# EAGLE design bmd-sbus-knobs-pic18-v1 (EAGLE 7.7.0)
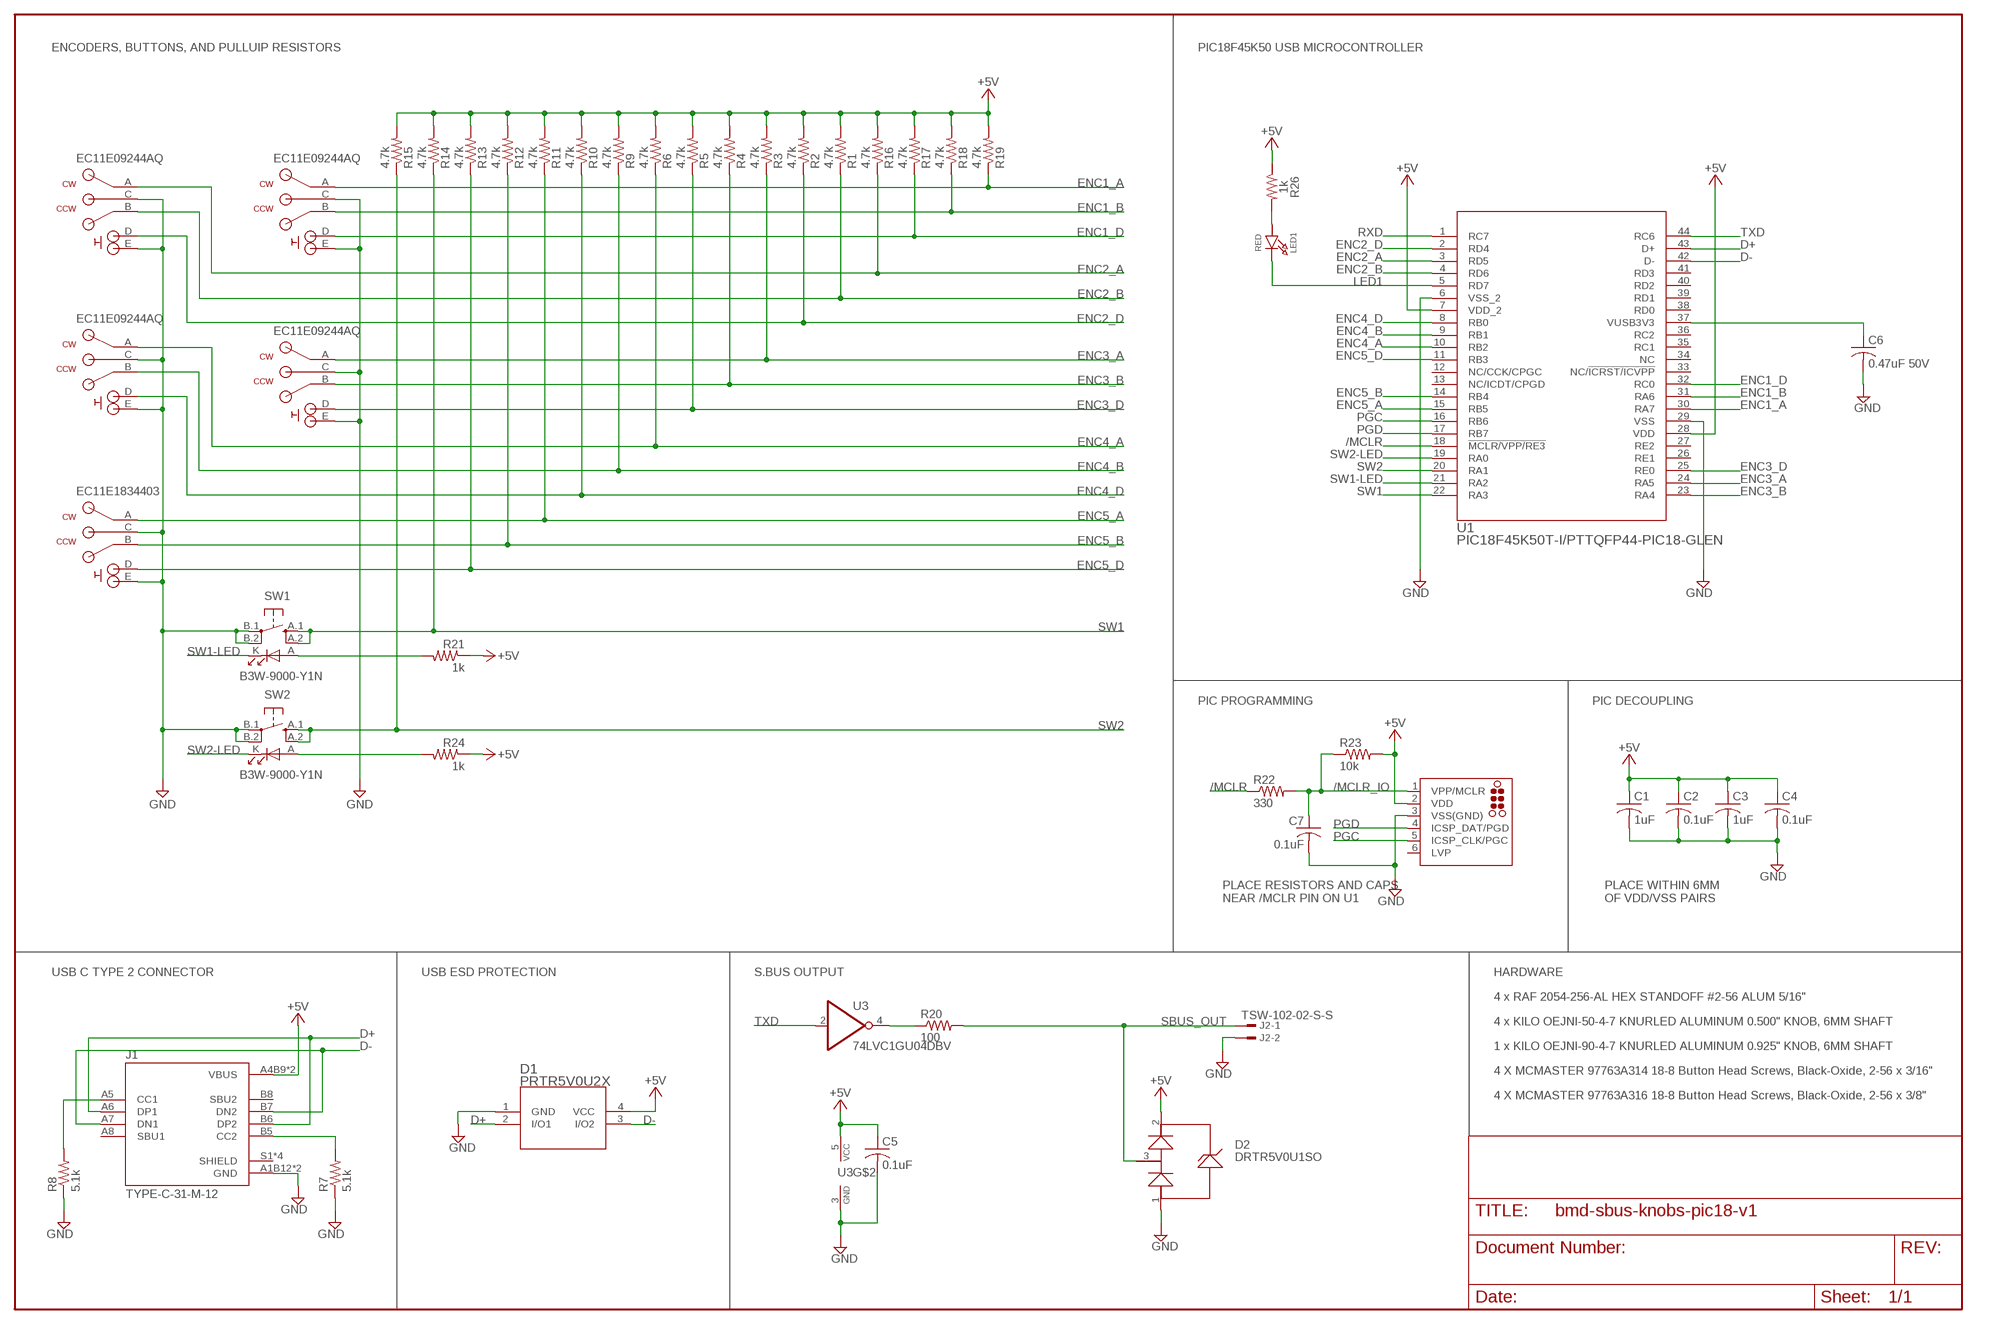
[diagram p0: schematic, sheet 1]

## Parts
C1  1uF  C-USC0603K  [C0603K]
C2  0.1uF  C-USC0603K  [C0603K]
C3  1uF  C-USC0603K  [C0603K]
C4  0.1uF  C-USC0603K  [C0603K]
C5  0.1uF  C-USC0603  [C0603]
C6  0.47uF 50V  C-USC1206K  [C1206K]
C7  0.1uF  C-USC0603K  [C0603K]
D1  PRTR5V0U2X  [SOT143B]
D2  DRTR5V0U1SO  [SOT23-3]
DEBUG  TC2030-MCP-NL  [TC2030-MCP-NL]
ENC1  EC11E15244B2  [EC11E15244B2]
ENC2  EC11E15244B2  [EC11E15244B2]
ENC3  EC11E15244B2  [EC11E15244B2]
ENC4  EC11E15244B2  [EC11E15244B2]
ENC5  EC11E15244B2  [EC11E15244B2]
J1  TYPE-C-31-M-12  [HRO_TYPE-C-31-M-12]
J2  TSW-102-02-S-S  [TSW-102-02-S-S]
LED1  RED  LED0805_NOOUTLINE  [CHIPLED_0805_NOOUTLINE]
R1  4.7k  R-US_R0603  [R0603]
R2  4.7k  R-US_R0603  [R0603]
R3  4.7k  R-US_R0603  [R0603]
R4  4.7k  R-US_R0603  [R0603]
R5  4.7k  R-US_R0603  [R0603]
R6  4.7k  R-US_R0603  [R0603]
R7  5.1k  R-US_R0603  [R0603]
R8  5.1k  R-US_R0603  [R0603]
R9  4.7k  R-US_R0603  [R0603]
R10  4.7k  R-US_R0603  [R0603]
R11  4.7k  R-US_R0603  [R0603]
R12  4.7k  R-US_R0603  [R0603]
R13  4.7k  R-US_R0603  [R0603]
R14  4.7k  R-US_R0603  [R0603]
R15  4.7k  R-US_R0603  [R0603]
R16  4.7k  R-US_R0603  [R0603]
R17  4.7k  R-US_R0603  [R0603]
R18  4.7k  R-US_R0603  [R0603]
R19  4.7k  R-US_R0603  [R0603]
R20  100  R-US_R0603  [R0603]
R21  1k  R-US_R0603  [R0603]
R22  330  R-US_R0603  [R0603]
R23  10k  R-US_R0603  [R0603]
R24  1k  R-US_R0603  [R0603]
R26  1k  R-US_R0603  [R0603]
SW1  B3W-9000-Y1N  OMRON-B3W-9000-B1N  [OMRON-B3W-ILLUM-BUTTON]
SW2  B3W-9000-Y1N  OMRON-B3W-9000-B1N  [OMRON-B3W-ILLUM-BUTTON]
U1  PIC18F45K50T-I/PTTQFP44-PIC18-GLEN  [TQFP44-PIC18-GLEN]
U3  74LVC1GU04DBV  74AHC1GU04DBV  [SOT23-5]

## Nets
+5V: C1.1 C2.1 C3.1 C4.1 C5.1 D1.4(VCC) D2.2 DEBUG.2(VDD) J1.A4B9(VBUS) J1.B4A9(VBUS) R1.2 R2.2 R3.2 R4.2 R5.2 R6.2 R9.2 R10.2 R11.2 R12.2 R13.2 R14.2 R15.2 R16.2 R17.2 R18.2 R19.2 R21.1 R23.2 R24.1 R26.1 U1.7(VDD_2) U1.28(VDD) U3.5(VCC)
/MCLR: R22.1 U1.18(!MCLR/VPP/RE3)
/MCLR_IO: C7.1 DEBUG.1(VPP/MCLR) R22.2 R23.1
CC1: J1.A5(CC1) R8.2
CC2: J1.B5(CC2) R7.2
D+: D1.2(I/O1) J1.A6(DP1) J1.B6(DP2) U1.43(D+)
D-: D1.3(I/O2) J1.A7(DN1) J1.B7(DN2) U1.42(D-)
ENC1_A: ENC1.A R19.1 U1.30(RA7)
ENC1_B: ENC1.B R18.1 U1.31(RA6)
ENC1_D: ENC1.D R17.1 U1.32(RC0)
ENC2_A: ENC2.A R16.1 U1.3(RD5)
ENC2_B: ENC2.B R1.1 U1.4(RD6)
ENC2_D: ENC2.D R2.1 U1.2(RD4)
ENC3_A: ENC3.A R3.1 U1.24(RA5)
ENC3_B: ENC3.B R4.1 U1.23(RA4)
ENC3_D: ENC3.D R5.1 U1.25(RE0)
ENC4_A: ENC4.A R6.1 U1.10(RB2)
ENC4_B: ENC4.B R9.1 U1.9(RB1)
ENC4_D: ENC4.D R10.1 U1.8(RB0)
ENC5_A: ENC5.A R11.1 U1.15(RB5)
ENC5_B: ENC5.B R12.1 U1.14(RB4)
ENC5_D: ENC5.D R13.1 U1.11(RB3)
GND: C1.2 C2.2 C3.2 C4.2 C5.2 C6.2 C7.2 D1.1(GND) D2.1 DEBUG.3(VSS(GND)) ENC1.C ENC1.E ENC2.C ENC2.E ENC3.C ENC3.E ENC4.C ENC4.E ENC5.C ENC5.E J1.A1B12(GND) J1.B1A12(GND) J2.2 R7.1 R8.1 SW1.B.1 SW1.B.2 SW2.B.1 SW2.B.2 U1.6(VSS_2) U1.29(VSS) U3.3(GND)
LED1: LED1.C U1.5(RD7)
N$2: R20.1 U3.4(O)
N$3: LED1.A R26.2
N$4: R21.2 SW1.A
N$5: R24.2 SW2.A
PGC: DEBUG.5(ICSP_CLK/PGC) U1.16(RB6)
PGD: DEBUG.4(ICSP_DAT/PGD) U1.17(RB7)
RXD: U1.1(RC7)
SBUS_OUT: D2.3 J2.1 R20.2
SW1: R14.1 SW1.A.1 SW1.A.2 U1.22(RA3)
SW1-LED: SW1.K U1.21(RA2)
SW2: R15.1 SW2.A.1 SW2.A.2 U1.20(RA1)
SW2-LED: SW2.K U1.19(RA0)
TXD: U1.44(RC6) U3.2(I)
VUSB: C6.1 U1.37(VUSB3V3)
Unconnected: DEBUG.6(LVP) J1.A8(SBU1) J1.B8(SBU2) J1.S1(SHIELD) J1.S2(SHIELD) J1.S3(SHIELD) J1.S4(SHIELD) U1.12(NC/CCK/CPGC) U1.13(NC/ICDT/CPGD) U1.26(RE1) U1.27(RE2) U1.33(NC/!ICRST/ICVPP) U1.34(NC) U1.35(RC1) U1.36(RC2) U1.38(RD0) U1.39(RD1) U1.40(RD2) U1.41(RD3)

## Notes on the sheet
- ENCODERS, BUTTONS, AND PULLUIP RESISTORS | PIC18F45K50 USB MICROCONTROLLER
- EC11E09244AQ | EC11E09244AQ
- EC11E09244AQ
- EC11E09244AQ
- EC11E1834403
- PIC PROGRAMMING | PIC DECOUPLING
- PLACE RESISTORS AND CAPS
  NEAR /MCLR PIN ON U1
- PLACE WITHIN 6MM
  OF VDD/VSS PAIRS
- USB C TYPE 2 CONNECTOR | USB ESD PROTECTION | S.BUS OUTPUT | HARDWARE
- 4 x RAF 2054-256-AL HEX STANDOFF #2-56 ALUM 5/16"
- 4 x KILO OEJNI-50-4-7 KNURLED ALUMINUM 0.500" KNOB, 6MM SHAFT
- 1 x KILO OEJNI-90-4-7 KNURLED ALUMINUM 0.925" KNOB, 6MM SHAFT
- 4 X MCMASTER 97763A314 18-8 Button Head Screws, Black-Oxide, 2-56 x 3/16"
- 4 X MCMASTER 97763A316 18-8 Button Head Screws, Black-Oxide, 2-56 x 3/8"

## Library data of the parts
C1-C5 C7 = rcl:C-US: CAPACITOR, American symbol
C6 = rcl:C-US: CAPACITOR, American symbol; MFR: KEMET; MFR_PART_NO: C1206C474K5RACTU
D1 = Nexperia_PRTR5V0U2X,215:PRTR5V0U2X; MANUFACTURER_PART_NUMBER: PRTR5V0U2X; VENDOR: NXP
D2 = GlenPartsLibrary:DRTR5V0U1SO; MFR: DIODES INC; MFR_PART_NO: DRTR5V0U1SO
DEBUG = tag-connect:TC2030: TAG-CONNECT ICSP Connector Manufacturer: Tag-Connect <http://www.tag-connect.com> Cable for easy In-Circuit Serial Programming. Designed for Microchip ICD2, suitable for many others. Two variants - one "with legs" (for hands-free fit on PCB) and another "without legs" for quick programming. PAD Description 1 MCLR/Vpp 2 Vdd 3 GND 4 PGD (ISPDAT) 5 PGC (ISPCLK) 6 nc (used for LVP) ©2009 ROFA.cz - modified and updated by Robert Darlington ‹rdarlington@gmail.com›
ENC1-ENC5 = GlenPartsLibrary:EC11E15244B2
J1 = TYPE-C-31-M-12-OSHPARK:TYPE-C-31-M-12: USB Connectors 24 Receptacle 1 8.94*7.3mm RoHS; AVAILABILITY: Unavailable; DESCRIPTION: USB Connectors 24 Receptacle 1 8.94*7.3mm RoHS; MF: HRO Electronics Co., Ltd.; MP: TYPE-C-31-M-12; PACKAGE: Package; PRICE: None
J2 = con-samtec:TSW-102-02-S-S: THROUGH-HOLE .025" SQ POST HEADER Source: Samtec TSW.pdf; OC_FARNELL: unknown; OC_NEWARK: unknown
LED1 = microbuilder:LED: LED 0603 - 0603 Surface Mount Package 2mA: Green LED - Low Power (3.9mcd, 2ma, 1.7Vf) - Digikey: 475-2709-2-ND Orange LED - Low Power (9.8mcd, 2ma, 1.8Vf) - Digikey: 475-1194-2-ND Red LED - Low Power (5mcd, 2ma, 1.8Vf) - Digikey: 475-1195-2-ND Yellow LED - Low Power (7mcd, 2ma, 1.8Vf) - Digikey: 475-1196-2-ND 5mA: Blue LED - Low Power (17mcd, 5ma, 2.9Vf) - Digikey: LNJ937W8CRACT-ND 0805 - 0805 Surface Mount Package 2mA: Red LED (8.8mcd, 2mA, 1.8Vf, Clear) - Low Power [Digikey: 475-2510-1-ND] Green LED (5mcd, 2mA, 1.8Vf, Clear) - Low Power [Digikey: 475-2730-1-ND] Yellow LED (11.3mcd, 2mA, 1.8Vf, Clear) - Low Power [Digikey: 475-2555-1-ND] 20mA: Red LED (104mcd, 20mA, Diffused) - LS R976 [Digikey: 475-1278-6-ND] Red LED (12mcd, 20mA, 2.0Vf, Clear) - APT2012EC [Digikey: 754-1128-1-ND] Green LED (15mcd, 20mA, 2.2Vf, Clear) - APT2012GC [Digikey: 754-1131-1-ND] Orange LED (160mcd, 20mA, 2.1Vf, Clear) - APT2012SECK [Digikey: 754-1130-1-ND] 1206 - 1206 Surface Mount Package Green LED (26mcd, 20mA, Diffused) - LG N971 [Digikey: 475-1407-6-ND] Red LED (15mcd, 20mA, Diffused) - LH N974 [Digikey: 475-1416-6-ND] Cree - Cree High-Power Surface Mount LEDs XPEBWT-L1-0000-00D50 - White 111lm 350mA 2.9Vf 6200K 110° XTEAWT-00-0000-00000LEE3 - White 114lm 350mA 2.85Vf 5000K 115° Everlight - Everlight 45-21 Series Surface Mount LEDs 45-21/QK2C-B2832AC2CB2/2T - Warm White 2000mcd 20mA 3.25Vf 3050K 120° 45-21/LK2C-B38452C4CB2/2T - Nuetral White 2000mcd 20mA 3.25Vf 4150K 120° 45-21/LK2C-B50634C6CB2/2T - Cold White 2200mcd 20mA 3.25Vf 5650K 120° PLCC2 Reverse Mount LS T77K-J1L2-1-0-2-R18-Z - Red 11.25mcd 2mA 1.8Vf 630nm 120° LO T77K-L1M2-24-Z - Orange 19.6mcd 2mA 1.8Vf 606nm 120° LY T77K-K2M1-26-Z - Yellow 15.7mcd 2mA 1.8Vf 587nm 120°
R1-R24 R26 = rcl:R-US_: RESISTOR, American symbol
SW1 SW2 = GlenPartsLibrary:OMRON-B3W-9000-B1N
U1 = PIC18F45K50:PIC18F45K50T-I/PT
U3 = 74xx-little-de:74*1GU04: Single Unbuffered Inverter

## Board
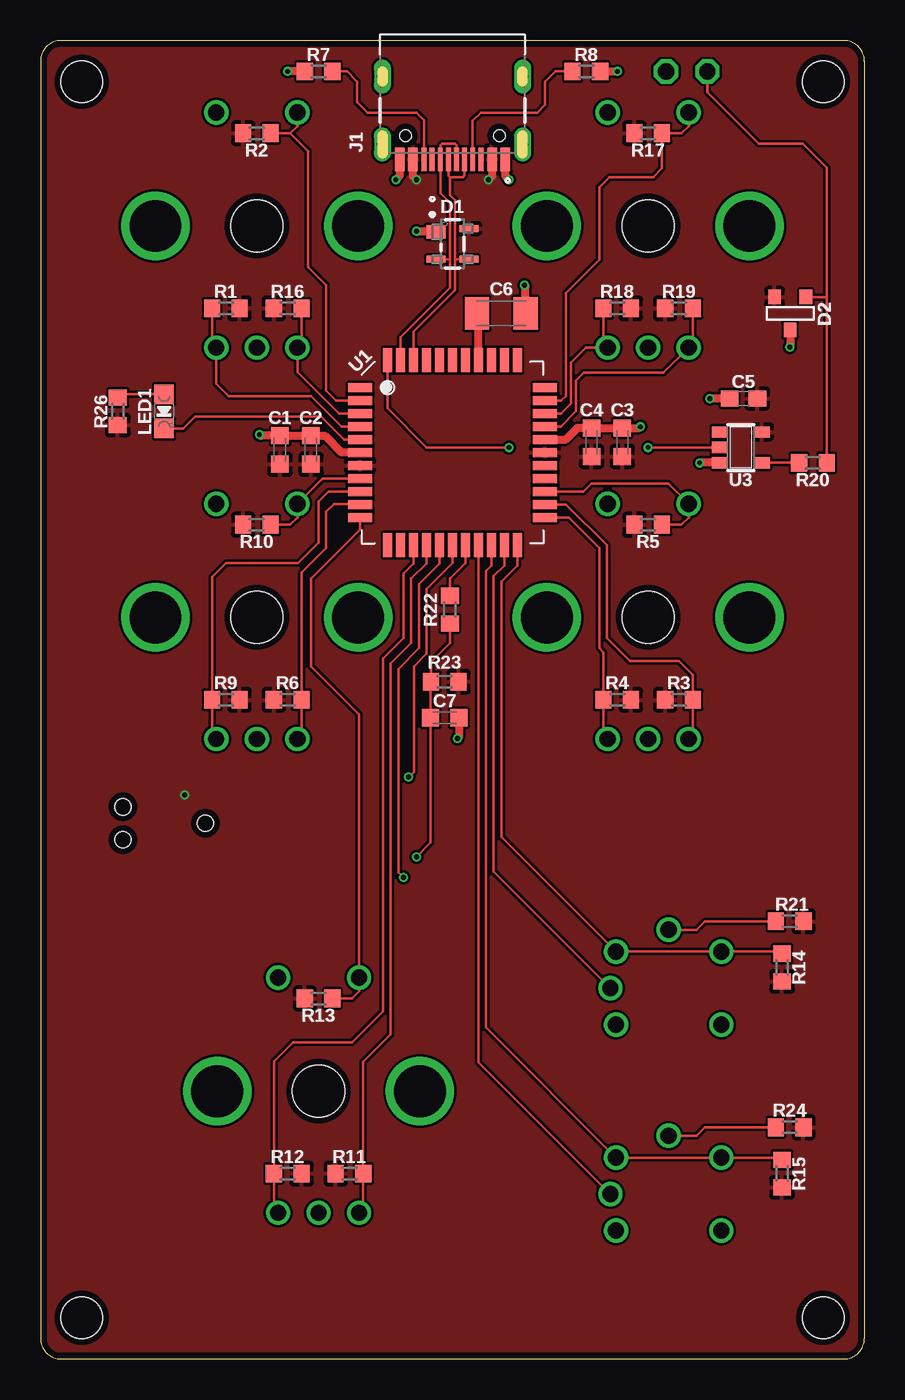
[diagram p1: board, top side]
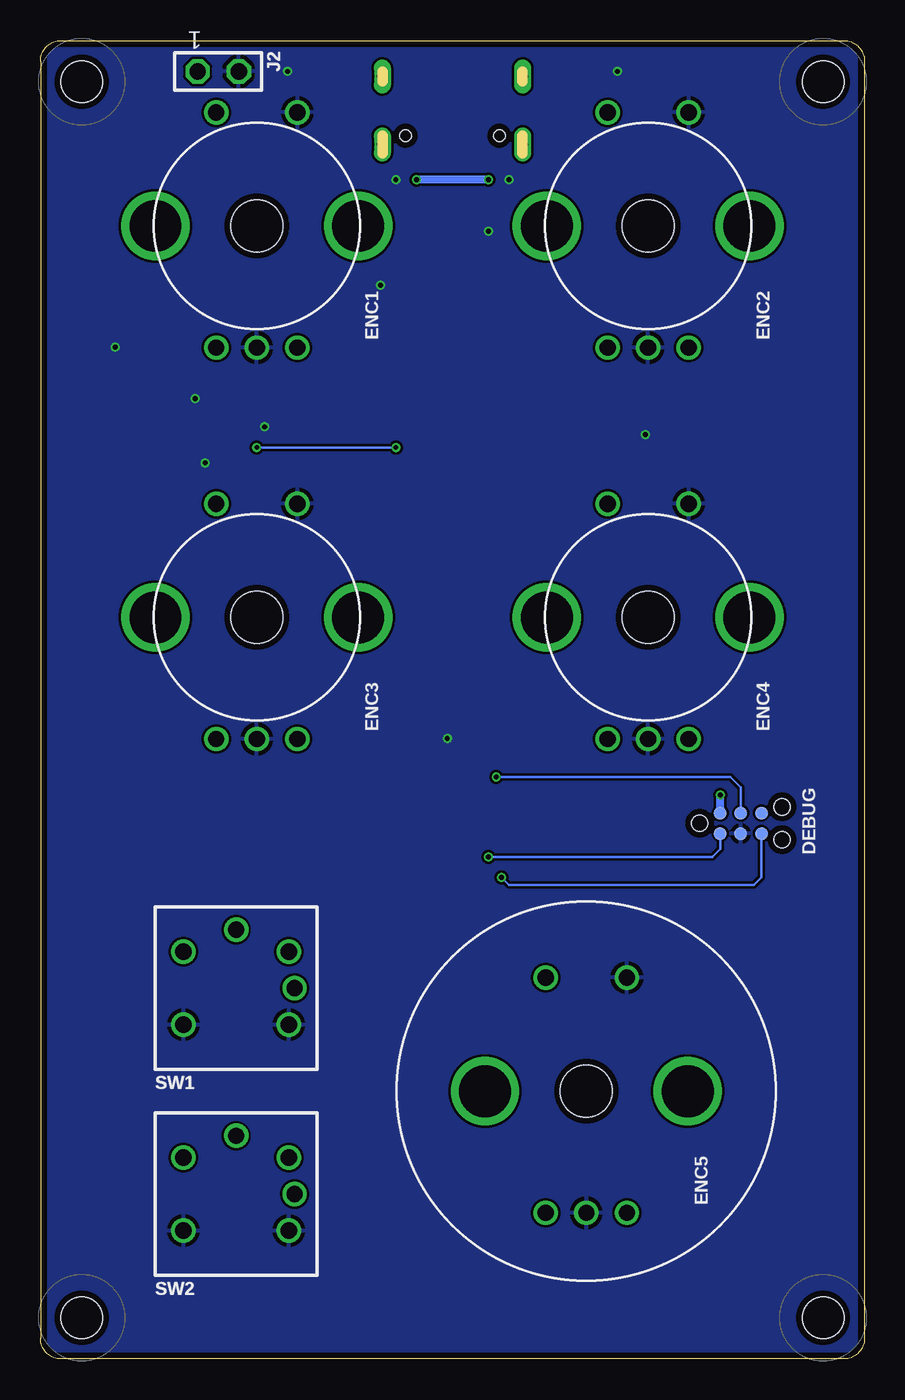
[diagram p2: board, bottom side, seen from below]

Size 50.8 x 81.28 mm. Coordinates in mm from the lower left corner, seen from the top.
Outline: 49.53,0 arc90 50.8,1.27 50.8,80.01 arc90 49.53,81.28 1.27,81.28 arc90 0,80.01 0,1.27 arc90 1.27,0 49.53,0
Copper layers (1*16): Top 0.035559375mm / dielectric 1.6mm / Bottom 0.035559375mm
Design rules "oshpark-2layer-2018": minimum track width 6mil, minimum drill 10mil, track to track 6mil, track to pad 6mil, pad to pad 6mil, via to via 6mil, smd to smd 6mil, copper to edge 15mil, drill to drill 6mil, minimum pad ring 5mil, minimum via ring 5mil, stop-mask expansion 2.5mil, vias tented up to drill 0mil, thermal gap 10mil
Holes 2.54 mm at 48.26,2.54 2.54,2.54 48.26,78.74 2.54,78.74
tKeepout: area 45.7,0 to 50.8,5.1; area 0,0 to 5.1,5.1; area 0,76.2 to 5.1,81.3; area 45.7,76.2 to 50.8,81.3
bKeepout: area 46.3,0 to 50.8,4.5; area 0,0 to 4.5,4.5; area 0,76.8 to 4.5,81.3; area 46.3,76.8 to 50.8,81.3

### Footprints (pad centres in the part's own frame; a part is rotated, then mirrored left to right if it is on the bottom)
C0603K = smd 1.05 x 1.08: 1 -0.875,0; 2 0.875,0
C0603 = smd 1.1 x 1: 1 -0.85,0; 2 0.85,0
C1206K = smd 1.5 x 2: 1 -1.5,0; 2 1.5,0
SOT143B = smd 0.838 x 1.168: 1 -0.747,-1.016 | smd 0.432 x 1.168: 2 0.95,-1.016; 3 0.95,1.016; 4 -0.95,1.016
SOT23-3 = smd 0.889 x 0.787: 1 1.016,0.025; 2 -1.016,-0.94; 3 -1.016,0.991
TC2030-MCP-NL = smd 0.787 x 0.787: 1 1.27,-0.635; 2 1.27,0.635; 3 2.54,-0.635; 4 2.54,0.635; 5 3.81,-0.635; 6 3.81,0.635 | hole 0.991: 0,0; 5.08,-1.016; 5.08,1.016
EC11E15244B2 = drill 1: A -2.5,-7.5; B 2.5,-7.5; C 0,-7.5; D -2.5,7; E 2.5,7 | drill 3.2: P$1 6.25,0; P$2 -6.25,0 | hole 3.2: 0,0
HRO_TYPE-C-31-M-12 = smd 0.6 x 1.45: A1B12 -3.25,5.095; A4B9 -2.45,5.095; B1A12 3.25,5.095; B4A9 2.45,5.095 | smd 0.3 x 1.45: A5 -1.25,5.095; A6 -0.25,5.095; A7 0.25,5.095; A8 1.25,5.095; B5 1.75,5.095; B6 0.75,5.095; B7 -0.75,5.095; B8 -1.75,5.095 | drill 0.65 pad 1.05 long: S1 -4.32,4.18; S2 4.32,4.18; S3 -4.32,0; S4 4.32,0 | hole 0.7: -2.89,3.65; 2.89,3.65
TSW-102-02-S-S = drill 1 pad 1.5 octagon: 1 1.27,0; 2 -1.27,0
CHIPLED_0805_NOOUTLINE = smd 1.2 x 1.2: A 0,-1.05; C 0,1.05
R0603 = smd 1 x 1.1: 1 -0.85,0; 2 0.85,0
OMRON-B3W-ILLUM-BUTTON = drill 1: A 0,3.6; A.1 -3.25,2.25; A.2 3.25,2.25; B.1 -3.25,-2.25; B.2 3.25,-2.25; K 3.6,0
TQFP44-PIC18-GLEN = smd 1.5 x 0.55: 1 -5.7,4; 2 -5.7,3.2; 3 -5.7,2.4; 4 -5.7,1.6; 5 -5.7,0.8; 6 -5.7,0; 7 -5.7,-0.8; 8 -5.7,-1.6; 9 -5.7,-2.4; 10 -5.7,-3.2; 11 -5.7,-4; 23 5.7,-4; 24 5.7,-3.2; 25 5.7,-2.4; 26 5.7,-1.6; 27 5.7,-0.8; 28 5.7,0; 29 5.7,0.8; 30 5.7,1.6; 31 5.7,2.4; 32 5.7,3.2; 33 5.7,4 | smd 0.55 x 1.5: 12 -4,-5.7; 13 -3.2,-5.7; 14 -2.4,-5.7; 15 -1.6,-5.7; 16 -0.8,-5.7; 17 0,-5.7; 18 0.8,-5.7; 19 1.6,-5.7; 20 2.4,-5.7; 21 3.2,-5.7; 22 4,-5.7; 34 4,5.7; 35 3.2,5.7; 36 2.4,5.7; 37 1.6,5.7; 38 0.8,5.7; 39 0,5.7; 40 -0.8,5.7; 41 -1.6,5.7; 42 -2.4,5.7; 43 -3.2,5.7; 44 -4,5.7
SOT23-5 = smd 0.69 x 0.99: 1 -0.95,-1.29; 2 0,-1.29; 3 0.95,-1.29; 4 0.95,1.3; 5 -0.95,1.3

### Placement (x,y rotation side)
C1  14.76,56.04 90 top
C2  16.67,56.04 90 top
C3  35.88,56.52 90 top
C4  33.97,56.52 90 top
C5  43.34,59.21 180 top
C6  28.42,64.45 0 top
C7  24.92,39.53 0 top
D1  25.4,68.74 270 top
D2  46.2,64.45 270 top
DEBUG  10.16,33.02 0 bottom
ENC1  37.47,69.85 0 bottom
ENC2  13.34,69.85 0 bottom
ENC3  37.47,45.72 0 bottom
ENC4  13.34,45.72 0 bottom
ENC5  17.14,16.51 0 bottom
J1  25.4,79.06 180 top
J2  39.85,79.38 180 bottom
LED1  7.62,58.42 180 top
R1  11.43,64.77 0 top
R2  13.34,75.56 180 top
R3  39.37,40.64 180 top
R4  35.56,40.64 0 top
R5  37.47,51.44 180 top
R6  15.24,40.64 180 top
R7  17.14,79.38 0 top
R8  33.66,79.38 180 top
R9  11.43,40.64 0 top
R10  13.34,51.44 180 top
R11  19.05,11.43 180 top
R12  15.24,11.43 0 top
R13  17.14,22.23 180 top
R14  45.72,24.13 270 top
R15  45.72,11.43 270 top
R16  15.24,64.77 180 top
R17  37.47,75.56 180 top
R18  35.56,64.77 0 top
R19  39.37,64.77 180 top
R20  47.62,55.24 0 top
R21  46.2,26.99 180 top
R22  25.24,46.2 270 top
R23  24.92,41.75 0 top
R24  46.2,14.29 180 top
R26  4.76,58.42 90 top
SW1  38.73,22.86 0 bottom
SW2  38.73,10.16 0 bottom
U1  25.4,55.88 0 top
U3  43.18,56.2 270 top

### Tracks (layer width: path | path; a pad name or v marks a point on that pad's centre or on a via)
+5V  (via drill 0.3)
  Top 0.254: D1.4
  Top 0.508: J1.B4A9 22.95,72.94 v23.18,72.71 | J1.A4B9 27.85,72.94 v27.62,72.71
  Bottom 0.508: v23.18,72.71 v27.62,72.71 | DEBUG.2 v8.89,34.77
  pour Top (isolate 0.152): 50.8,0 0,0 0,81.28 50.8,81.28
/MCLR
  Top 0.152: U1.18 26.2,49.06 25.24,48.1 R22.1
/MCLR_IO  (via drill 0.3)
  Top 0.152: v23.18,30.96 24.05,31.83 C7.1 24.05,41.73 R23.1 24.07,42.97 25.24,44.13 R22.2
  Bottom 0.152: v23.18,30.96 9.37,30.96 8.89,31.43 DEBUG.1
CC1
  Top 0.152: J1.A5 26.65,76.34 27.15,76.83 30.64,76.83 31.11,77.31 31.11,78.74 31.75,79.38 R8.2
CC2
  Top 0.152: R7.2 18.89,79.38 19.53,78.74 19.53,77.47 20.16,76.83 23.18,76.83 23.65,76.36 J1.B5
D+
  Top 0.152: J1.A6 25.65,74.84 25.56,74.93 24.77,74.93 24.65,74.81 J1.B6 24.65,71.87 25.24,71.28 25.24,67.79 | D1.2 25.24,67.79 | U1.43 22.2,63 25.24,66.04 25.24,67.79
D-
  Top 0.152: D1.3 25.72,67.79 25.56,67.79 | J1.B7 26.15,72.98 26.04,72.87 25.24,72.87 | J1.A7 25.15,72.96 25.24,72.87 | 25.24,72.87 25.24,71.75 25.56,71.44 25.56,67.79 | U1.42 23,63.32 25.56,65.88 25.56,67.79
ENC1_A
  Top 0.152: R19.1 40.22,62.6 ENC1.A 38.42,60.8 33.5,60.8 33.02,60.33 33.02,58.42 32.08,57.48 U1.30
ENC1_B
  Top 0.152: R18.1 34.71,62.6 ENC1.B 33.62,62.35 32.7,61.44 32.7,58.9 32.09,58.28 U1.31
ENC1_D
  Top 0.152: ENC1.D 39.97,76 39.53,75.56 R17.1 38.31,73.4 37.78,72.87 35.08,72.87 34.45,72.23 34.45,67.79 32.38,65.72 32.38,59.37 32.09,59.08 U1.32
ENC2_A
  Top 0.152: R16.1 16.09,62.6 ENC2.A 15.84,60.84 18.4,58.28 U1.3
ENC2_B
  Top 0.152: R1.1 10.58,62.6 ENC2.B 10.84,60.13 11.59,59.37 16.67,59.37 18.56,57.48 U1.4
ENC2_D
  Top 0.152: ENC2.D 15.84,76 15.4,75.56 | 15.4,75.56 R2.1 | U1.2 18.23,59.08 17.62,59.69 17.62,66.2 16.51,67.31 16.51,74.45 15.4,75.56
ENC3_A
  Top 0.152: ENC3.A 40.22,38.48 R3.1 40.22,42.17 39.37,43.02 36.35,43.02 34.92,44.45 34.92,50.16 32.41,52.68 U1.24
ENC3_B
  Top 0.152: ENC3.B 34.71,38.48 R4.1 34.71,43.55 34.45,43.81 34.45,50.01 32.58,51.88 U1.23
ENC3_D
  Top 0.152: R5.1 39.53,51.44 39.97,51.87 ENC3.D 38.71,53.98 33.97,53.98 33.48,53.48 U1.25
ENC4_A
  Top 0.152: ENC4.A 16.09,38.48 R6.1 16.09,48.48 17.62,50.01 17.62,52.23 18.1,52.7 19.68,52.7 U1.10
ENC4_B
  Top 0.152: ENC4.B 10.58,38.48 R9.1 10.58,48.2 11.43,49.05 15.88,49.05 17.14,50.32 17.14,52.86 17.76,53.48 U1.9
ENC4_D
  Top 0.152: R10.1 15.4,51.44 15.84,51.87 ENC4.D 17.39,54.28 U1.8
ENC5_A
  Top 0.152: ENC5.A 19.9,9.27 R11.1 19.9,18.31 21.59,20 21.59,42.86 22.86,44.13 22.86,48.1 23.8,49.04 U1.15
ENC5_B
  Top 0.152: ENC5.B 14.39,9.27 R12.1 14.39,18.36 15.56,19.53 19.21,19.53 21.11,21.43 21.11,43.18 22.38,44.45 22.38,48.42 23,49.03 U1.14
ENC5_D
  Top 0.152: R13.1 19.21,22.23 19.64,22.66 ENC5.D 19.64,39.73 16.67,42.7 16.67,48.1 19.7,51.13 U1.11
GND  (via drill 0.3)
  Top 0.508: R7.1 v15.24,79.38 | R8.1 v35.56,79.38 | D1.1 23.22,69.49 v23.18,69.53 | J1.B1A12 22.15,72.95 v21.91,72.71 | J1.A1B12 28.65,72.95 v28.89,72.71 | C5.2 v41.27,59.21 | U3.3 v40.64,55.25 v40.64,55.24 | C6.2 29.92,66.13 v29.84,66.2 | U1.29 32.39,56.68 33.1,57.39 C4.2 C3.2 36.91,57.39 v36.99,57.47 | U1.6 18.57,55.88 17.54,56.91 C2.2 C1.2 13.57,56.91 v13.49,56.99 | D2.1 46.22,62.41 v46.2,62.39 | C7.2 25.8,38.34 v25.72,38.26
  pour Bottom (isolate 0.152): 50.8,0 0,0 0,81.28 50.8,81.28
LED1
  Top 0.152: U1.5 18.73,56.68 17.3,58.1 9.53,58.1 8.79,57.37 LED1.C
N$2
  Top 0.152: U3.4 R20.1
N$3
  Top 0.152: LED1.A 4.96,59.47 R26.2
N$4
  Top 0.152: SW1.A 40.43,26.46 40.96,26.99 R21.2
N$5
  Top 0.152: SW2.A 40.43,13.76 40.96,14.29 R24.2
PGC  (via drill 0.3)
  Top 0.152: U1.16 24.6,49.05 23.34,47.78 23.34,43.81 22.07,42.55 22.07,30 v22.38,29.69
  Bottom 0.152: DEBUG.5 6.35,29.69 6.83,29.21 21.91,29.21 v22.38,29.69
PGD  (via drill 0.3)
  Top 0.152: U1.17 25.4,49.05 23.81,47.47 23.81,43.5 23.02,42.7 23.02,36.2 v22.7,35.88
  Bottom 0.152: v22.7,35.88 8.26,35.88 7.62,35.24 DEBUG.4
SBUS_OUT
  Top 0.152: J2.1 41.12,78.11 44.29,74.93 46.99,74.93 48.48,73.44 48.48,65.41 | R20.2 48.48,65.41 | D2.3 48.41,65.47 48.48,65.41
SW1
  Top 0.152: R14.1 45.59,25.11 SW1.A.1 SW1.A.2 28.42,32.18 28.42,47.94 29.4,48.93 U1.22
SW1-LED
  Top 0.152: U1.21 28.6,48.92 27.94,48.26 27.94,30.05 SW1.K
SW2
  Top 0.152: R15.1 45.59,12.41 SW2.A.1 SW2.A.2 27.46,20.43 27.46,48.58 27.8,48.91 U1.20
SW2-LED
  Top 0.152: U1.19 27,18.3 SW2.K
TXD  (via drill 0.3)
  Top 0.152: U1.44 21.4,58.61 23.81,56.2 v28.89,56.2 | v37.47,56.2 U3.2
  Bottom 0.152: v28.89,56.2 v37.47,56.2
VUSB
  Top 0.152: 27,64.37 C6.1
  Top 0.508: U1.37 27,64.37

### Text on the board
_tsilk: R7 | R8 | R2 | R17 | J1 | D1 | C6 | R1 | R16 | R18 | R19 | D2 | U1 | C5 | R26 | LED1 | C1 | C2 | C4 | C3 | U3 | R20 | R10 | R5 | R22 | R23 | R9 | R6 | R4 | R3 | C7 | R21 | R14 | R13 | R24 | R12 | R11 | R15
_bsilk: J2 | DEBUG | SW1 | SW2